# Altium schematic sheet ETH.SchDoc
size A4; SheetNumber: 9; SheetTotal: 10
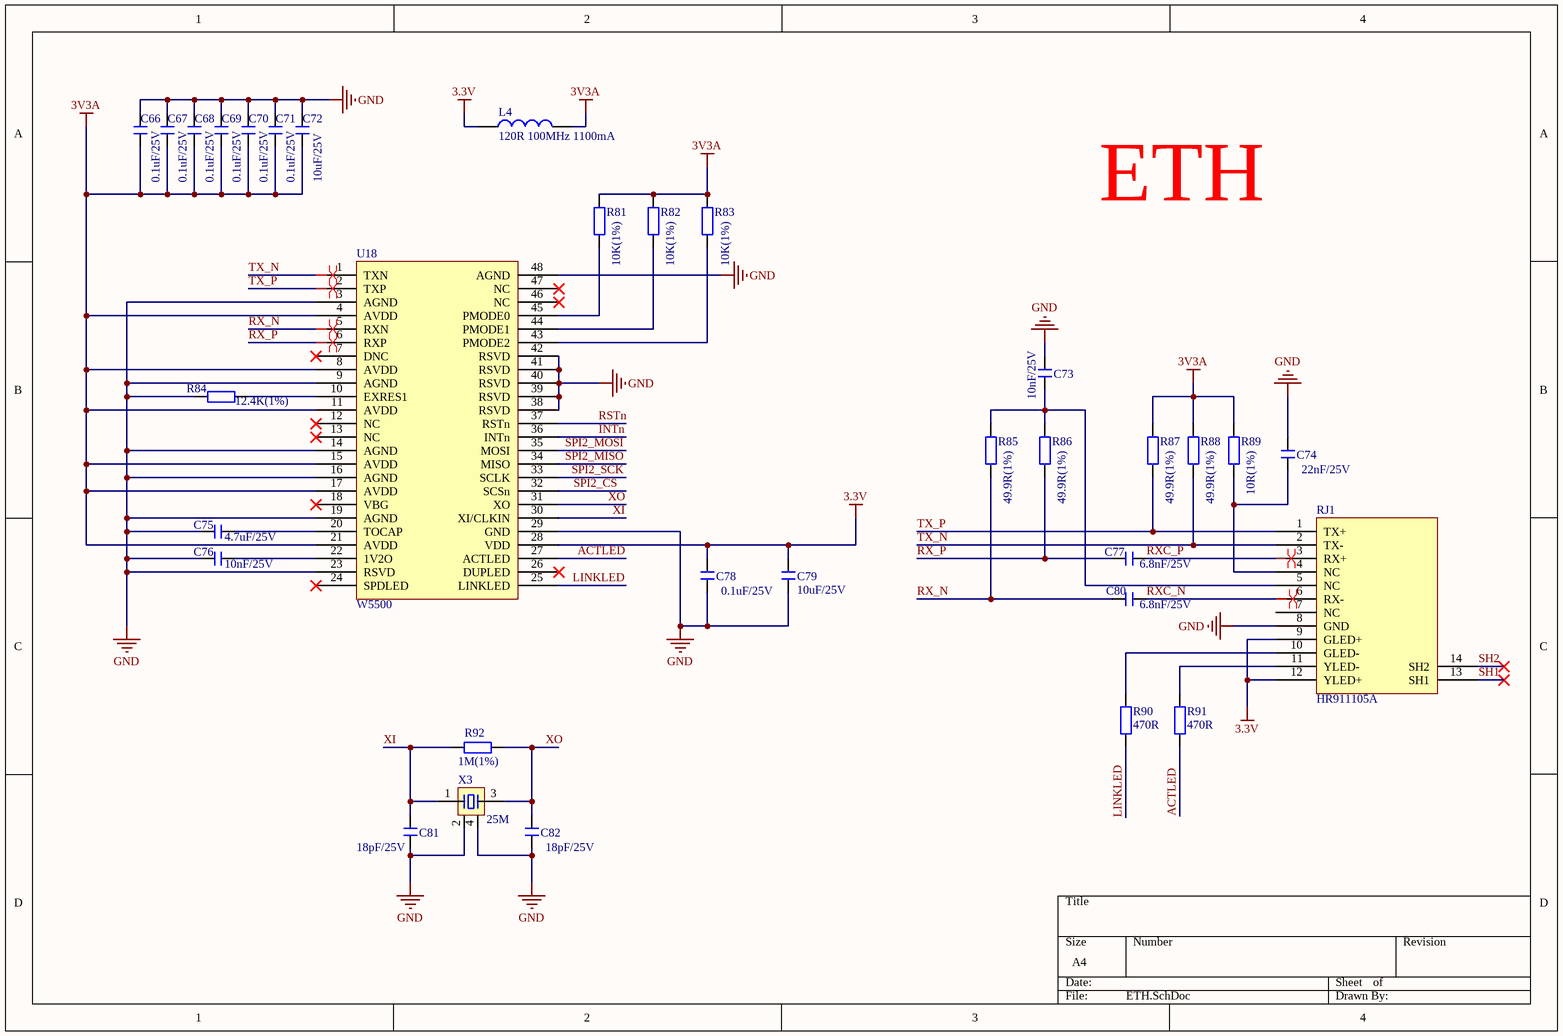
[diagram p0: ETH.SchDoc]

## Parts
C66  0.1uF/25V  [C 0603_L]
C67  0.1uF/25V  [C 0603_L]
C68  0.1uF/25V  [C 0603_L]
C69  0.1uF/25V  [C 0603_L]
C70  0.1uF/25V  [C 0603_L]
C71  0.1uF/25V  [C 0603_L]
C72  10uF/25V  [C 0603_L]
C73  10nF/25V  [C 0603_L]
C74  22nF/25V  [C 0603_L]
C75  4.7uF/25V  [C 0603_L]
C76  10nF/25V  [C 0603_L]
C77  6.8nF/25V  [C 0603_L]
C78  0.1uF/25V  [C 0603_L]
C79  10uF/25V  [C 0603_L]
C80  6.8nF/25V  [C 0603_L]
C81  18pF/25V  [C 0603_L]
C82  18pF/25V  [C 0603_L]
L4  120R 100MHz 1100mA  [L 0603]
R81  10K(1%)  [R 0603_L]
R82  10K(1%)  [R 0603_L]
R83  10K(1%)  [R 0603_L]
R84  12.4K(1%)  [R 0603_L]
R85  49.9R(1%)  [R 0603_L]
R86  49.9R(1%)  [R 0603_L]
R87  49.9R(1%)  [R 0603_L]
R88  49.9R(1%)  [R 0603_L]
R89  10R(1%)  [R 0603_L]
R90  470R  [R 0603_L]
R91  470R  [R 0603_L]
R92  1M(1%)  [R 0603_L]
RJ1  HR911105A  [RJ-45A12]
U18  W5500  [LQFP48 7X7_N]
X3  25M  [OSC 3225-4P]

## Nets
3.3V: C78.1 C79.1 L4.1 RJ1.9(GLED+) RJ1.12(YLED+) U18.28(VDD)
3V3A: C66.2 C67.2 C68.2 C69.2 C70.2 C71.2 C72.2 L4.2 R81.1 R82.1 R83.1 R87.1 R88.1 R89.1 U18.4(AVDD) U18.8(AVDD) U18.11(AVDD) U18.15(AVDD) U18.17(AVDD) U18.21(AVDD)
GND: C66.1 C67.1 C68.1 C69.1 C70.1 C71.1 C72.1 C73.1 C74.1 C75.2 C76.2 C78.2 C79.2 C81.2 C82.2 R84.2 RJ1.8(GND) U18.3(AGND) U18.9(AGND) U18.14(AGND) U18.16(AGND) U18.19(AGND) U18.23(RSVD) U18.29(GND) U18.38(RSVD) U18.39(RSVD) U18.40(RSVD) U18.41(RSVD) U18.42(RSVD) U18.48(AGND) X3.2 X3.4
ACTLED: R91.2 U18.27(ACTLED)
INTn: U18.36(INTn)
LINKLED: R90.2 U18.25(LINKLED)
RSTn: U18.37(RSTn)
RX_N: C80.1 R85.2 U18.5(RXN)
RX_P: C77.1 R86.2 U18.6(RXP)
RXC_N: C80.2 RJ1.6(RX-)
RXC_P: C77.2 RJ1.3(RX+)
SH1: RJ1.13(SH1)
SH2: RJ1.14(SH2)
SPI2_CS: U18.32(SCSn)
SPI2_MISO: U18.34(MISO)
SPI2_MOSI: U18.35(MOSI)
SPI2_SCK: U18.33(SCLK)
TX_N: R88.2 RJ1.2(TX-) U18.1(TXN)
TX_P: R87.2 RJ1.1(TX+) U18.2(TXP)
XI: C81.1 R92.2 U18.30(XI/CLKIN) X3.1
XO: C82.1 R92.1 U18.31(XO) X3.3
NetC73_2: C73.2 R85.1 R86.1 RJ1.5(NC)
NetC74_2: C74.2 R89.2 RJ1.4(NC)
NetC75_1: C75.1 U18.20(TOCAP)
NetC76_1: C76.1 U18.22(1V2O)
NetR81_2: R81.2 U18.45(PMODE0)
NetR82_2: R82.2 U18.44(PMODE1)
NetR83_2: R83.2 U18.43(PMODE2)
NetR84_1: R84.1 U18.10(EXRES1)
NetR90_1: R90.1 RJ1.10(GLED-)
NetR91_1: R91.1 RJ1.11(YLED-)

Not connected (* = marked no-connect by the designer): RJ1 7(NC); U18 7(DNC)* 12(NC)* 13(NC)* 18(VBG)* 24(SPDLED)* 26(DUPLED)* 46(NC)* 47(NC)*

## Layout directives
differential pair: RX_N, RX_P, RXC_N, RXC_P, TX_N, TX_P

## Notes on the sheet
- ETH

## Library data of the parts
C66-C82 = C: 无极性贴片电容; 版权归属: 源创客; BOM名称: 无极性贴片电容; 学习资源: www.ooocke.com
L4 = L: 磁珠 HH-1M1608-121JT; BOM名称: 小功率贴片电感; 版权归属: 源创客; 学习资源: www.ooocke.com
R81-R92 = R: 贴片电阻; 版权归属: 源创客; BOM名称: 贴片电阻; 学习资源: www.ooocke.com
RJ1 = HR911105A: 带灯以太网接口
X3 = XTAL-4P: 4脚无源晶振; 版权归属: 源创客; BOM名称: 4脚无源晶振; 学习资源: www.ooocke.com